# EAGLE schematic PCB-ARD-MMBOS (EAGLE 7.1.0)
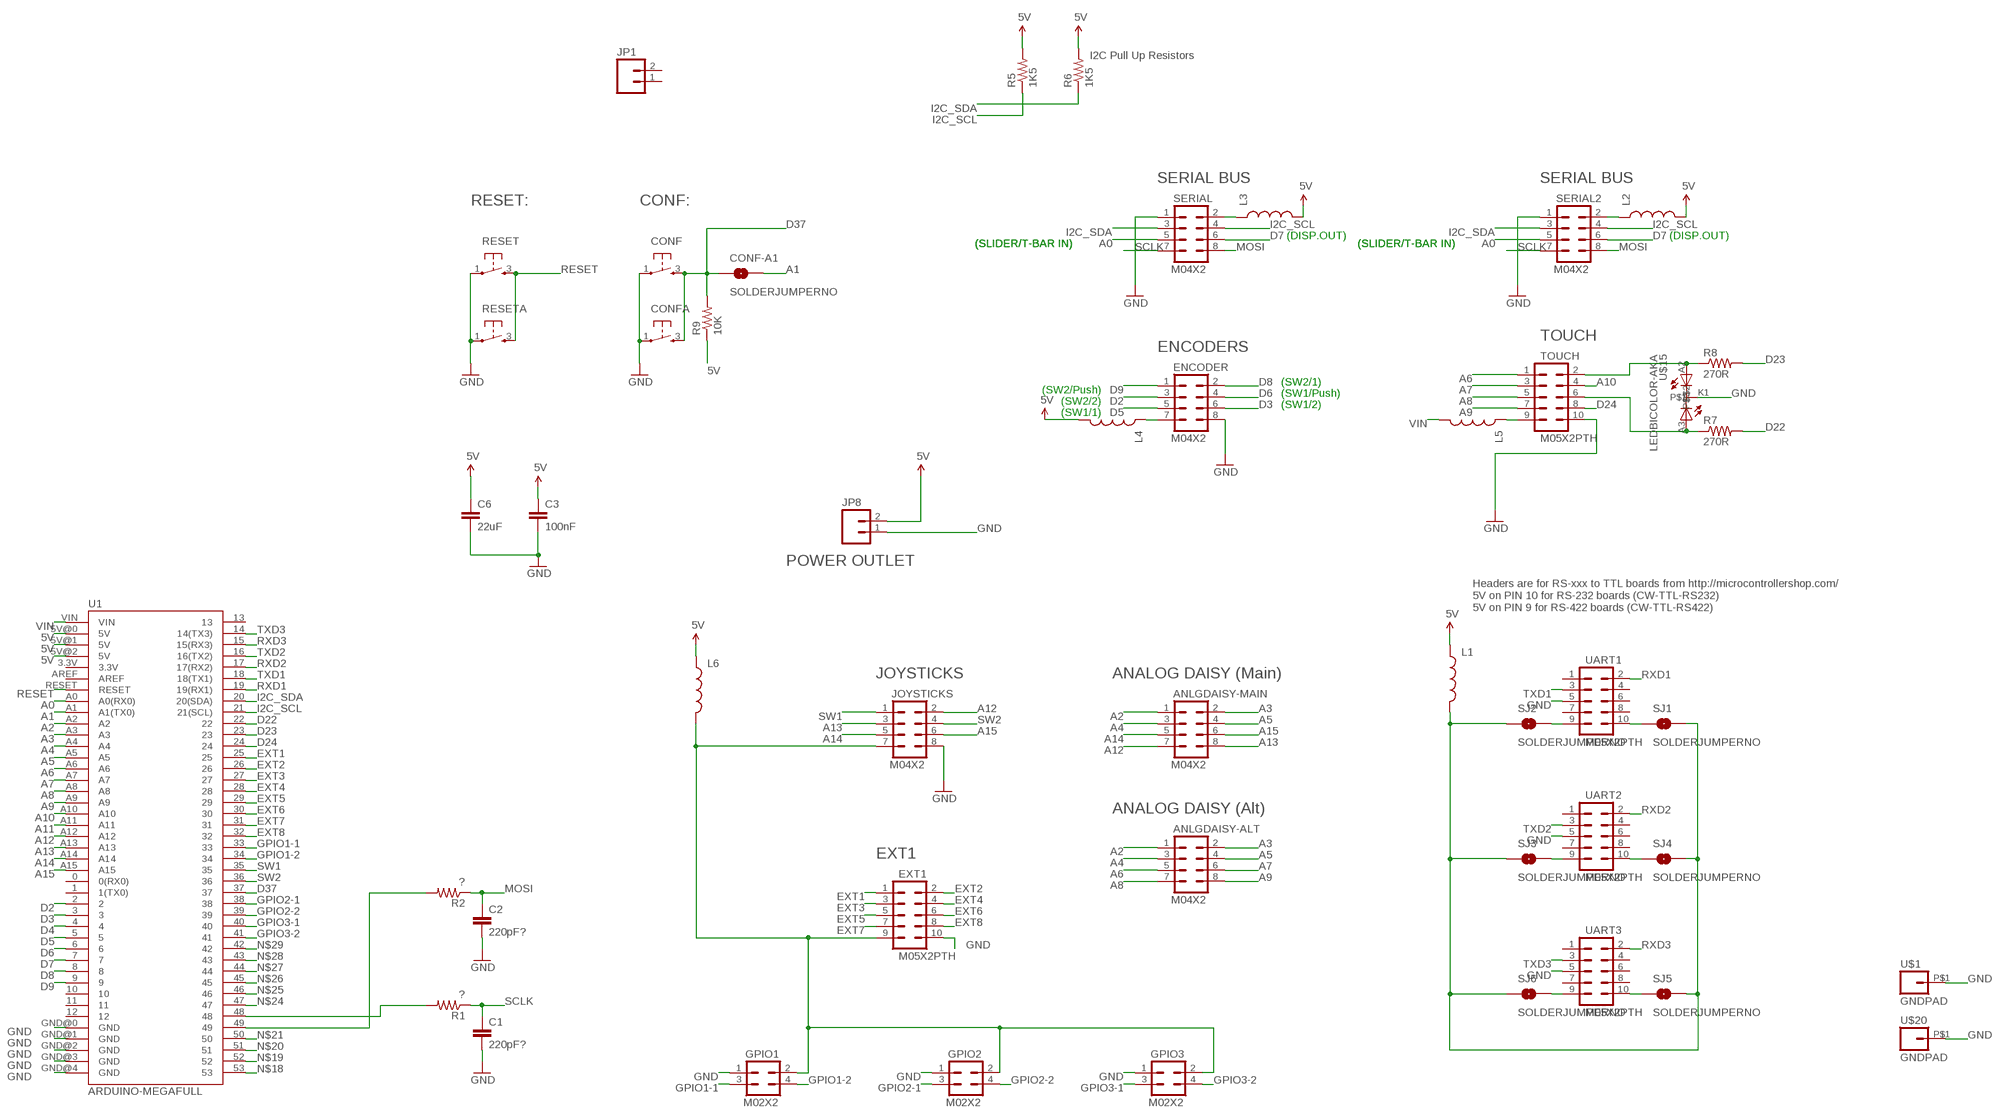
[diagram p0: schematic, sheet 1]

## Parts
ANLGDAISY-ALT  M04X2  [2X4]
ANLGDAISY-MAIN  M04X2  [2X4]
C1  220pF?  CAP0603-CAP  [0603-CAP]
C2  220pF?  CAP0603-CAP  [0603-CAP]
C3  100nF  CAP0603-CAP  [0603-CAP]
C6  22uF  CAP0805  [0805]
CONF  TAC_SWITCH  [PUSHBUTTON]
CONF-A1  SOLDERJUMPERNO  [SJ_2S-NO]
CONFA  TAC_SWITCH  [PUSHBUTTON]
ENCODER  M04X2  [2X4]
EXT1  M05X2PTH  [AVR_ICSP]
GPIO1  M02X2  [2X2]
GPIO2  M02X2  [2X2]
GPIO3  M02X2  [2X2]
JOYSTICKS  M04X2  [2X4]
JP1  M02PTH  [1X02]
JP8  M02PTH4  [1X02_XTRA_BIG]
L1  INDUCTOR0805  [0805]
L2  INDUCTOR0805  [0805]
L3  INDUCTOR0805  [0805]
L4  INDUCTOR0805  [0805]
L5  INDUCTOR0805  [0805]
L6  INDUCTOR0805  [0805]
R1  ?  RESISTOR0603-RES  [0603-RES]
R2  ?  RESISTOR0603-RES  [0603-RES]
R5  1K5  RESISTOR0603-RES  [0603-RES]
R6  1K5  RESISTOR0603-RES  [0603-RES]
R7  270R  RESISTOR0603-RES  [0603-RES]
R8  270R  RESISTOR0603-RES  [0603-RES]
R9  10K  RESISTOR0603-RES  [0603-RES]
RESET  TAC_SWITCH  [PUSHBUTTON]
RESETA  TAC_SWITCH  [PUSHBUTTON]
SERIAL  M04X2  [2X4]
SERIAL2  M04X2  [2X4]
SJ1  SOLDERJUMPERNO  [SJ_2S-NO]
SJ2  SOLDERJUMPERNO  [SJ_2S-NO]
SJ3  SOLDERJUMPERNO  [SJ_2S-NO]
SJ4  SOLDERJUMPERNO  [SJ_2S-NO]
SJ5  SOLDERJUMPERNO  [SJ_2S-NO]
SJ6  SOLDERJUMPERNO  [SJ_2S-NO]
TOUCH  M05X2PTH  [AVR_ICSP]
U1  ARDUINO-MEGAFULL  [ARDUINO_MEGA]
U$1  GNDPAD  [3.2MMPAD]
U$15  LEDBICOLOR-AKA  [LED5MM-BICOLOR]
U$20  GNDPAD  [3.2MMPAD]
UART1  M05X2PTH  [AVR_ICSP]
UART2  M05X2PTH  [AVR_ICSP]
UART3  M05X2PTH  [AVR_ICSP]

## Nets
5V [Power]: C3.1 C6.1 JP8.2 L1.1 L2.2 L3.2 L4.2 L6.1 R5.2 R6.2 R9.1 U1.5V@0(5V) U1.5V@1(5V) U1.5V@2(5V)
A0: SERIAL2.5 SERIAL.5 U1.A0(A0(RX0))
A1: CONF-A1.2 U1.A1(A1(TX0))
A2: ANLGDAISY-ALT.1 ANLGDAISY-MAIN.1 U1.A2
A3: ANLGDAISY-ALT.2 ANLGDAISY-MAIN.2 U1.A3
A4: ANLGDAISY-ALT.3 ANLGDAISY-MAIN.3 U1.A4
A5: ANLGDAISY-ALT.4 ANLGDAISY-MAIN.4 U1.A5
A6: ANLGDAISY-ALT.5 TOUCH.1 U1.A6
A7: ANLGDAISY-ALT.6 TOUCH.3 U1.A7
A8: ANLGDAISY-ALT.7 TOUCH.5 U1.A8
A9: ANLGDAISY-ALT.8 TOUCH.7 U1.A9
A10: TOUCH.4 U1.A10
A11: U1.A11
A12: ANLGDAISY-MAIN.7 JOYSTICKS.2 U1.A12
A13: ANLGDAISY-MAIN.8 JOYSTICKS.3 U1.A13
A14: ANLGDAISY-MAIN.5 JOYSTICKS.5 U1.A14
A15: ANLGDAISY-MAIN.6 JOYSTICKS.6 U1.A15
D2: ENCODER.3 U1.2
D3: ENCODER.6 U1.3
D4: U1.4
D5: ENCODER.5 U1.5
D6: ENCODER.4 U1.6
D7: SERIAL2.6 SERIAL.6 U1.7
D8: ENCODER.2 U1.8
D9: ENCODER.1 U1.9
D22: R7.2 U1.22
D23: R8.2 U1.23
D24: TOUCH.8 U1.24
D37: CONF-A1.1 CONF.3 CONFA.3 R9.2 U1.37
EXT1: EXT1.1 U1.25
EXT2: EXT1.2 U1.26
EXT3: EXT1.3 U1.27
EXT4: EXT1.4 U1.28
EXT5: EXT1.5 U1.29
EXT6: EXT1.6 U1.30
EXT7: EXT1.7 U1.31
EXT8: EXT1.8 U1.32
GND [Power]: C1.2 C2.2 C3.2 C6.2 CONF.1 CONFA.1 ENCODER.8 EXT1.10 GPIO1.1 GPIO2.1 GPIO3.1 JOYSTICKS.8 JP8.1 RESET.1 RESETA.1 SERIAL2.1 SERIAL.1 TOUCH.10 U1.GND@0(GND) U1.GND@1(GND) U1.GND@2(GND) U1.GND@3(GND) U1.GND@4(GND) U$1.P$1 U$15.K1 U$20.P$1 UART1.5 UART2.5 UART3.5
GPIO1-1: GPIO1.3 U1.33
GPIO1-2: GPIO1.4 U1.34
GPIO2-1: GPIO2.3 U1.38
GPIO2-2: GPIO2.4 U1.39
GPIO3-1: GPIO3.3 U1.40
GPIO3-2: GPIO3.4 U1.41
I2C_SCL: R5.1 SERIAL2.4 SERIAL.4 U1.21(21(SCL))
I2C_SDA: R6.1 SERIAL2.3 SERIAL.3 U1.20(20(SDA))
MOSI: C2.1 R2.1 SERIAL2.8 SERIAL.8
N$1 [Power]: L2.1 SERIAL2.2
N$2 [Power]: L3.1 SERIAL.2
N$3: SJ6.2 UART3.9
N$4 [Power]: ENCODER.7 L4.1
N$5 [Power]: L5.1 TOUCH.9
N$6: SJ3.2 UART2.9
N$7 [Power]: EXT1.9 GPIO1.2 GPIO2.2 GPIO3.2 JOYSTICKS.7 L6.2
N$8 [Power]: L1.2 SJ1.2 SJ2.1 SJ3.1 SJ4.2 SJ5.2 SJ6.1
N$9: SJ2.2 UART1.9
N$10: SJ1.1 UART1.10
N$11: R1.2 U1.48
N$12: SJ4.1 UART2.10
N$13: SJ5.1 UART3.10
N$14: R2.2 U1.49
N$17: R8.1 TOUCH.2 U$15.A2
N$18: U1.53
N$19: U1.52
N$20: U1.51
N$21: U1.50
N$22: R7.1 TOUCH.6 U$15.A3
N$24: U1.47
N$25: U1.46
N$26: U1.45
N$27: U1.44
N$28: U1.43
N$29: U1.42
RESET: RESET.3 RESETA.3 U1.RESET
RXD1: U1.19(19(RX1)) UART1.2
RXD2: U1.17(17(RX2)) UART2.2
RXD3: U1.15(15(RX3)) UART3.2
SCLK: C1.1 R1.1 SERIAL2.7 SERIAL.7
SW1: JOYSTICKS.1 U1.35
SW2: JOYSTICKS.4 U1.36
TXD1: U1.18(18(TX1)) UART1.3
TXD2: U1.16(16(TX2)) UART2.3
TXD3: U1.14(14(TX3)) UART3.3
VIN [Power]: L5.2 U1.VIN
Unconnected: JP1.1 JP1.2 U1.0(0(RX0)) U1.1(1(TX0)) U1.3.3V U1.10 U1.11 U1.12 U1.13 U1.AREF UART1.1 UART1.4 UART1.6 UART1.7 UART1.8 UART2.1 UART2.4 UART2.6 UART2.7 UART2.8 UART3.1 UART3.4 UART3.6 UART3.7 UART3.8

## Notes on the sheet
- I2C Pull Up Resistors
- SERIAL BUS | SERIAL BUS
- RESET: | CONF:
- (DISP.OUT) | (DISP.OUT)
- (SLIDER/T-BAR IN) | (SLIDER/T-BAR IN) | (SLIDER/T-BAR IN) | (SLIDER/T-BAR IN)
- TOUCH
- ENCODERS
- (SW2/Push) | (SW2/1)
- (SW2/2) | (SW1/Push)
- (SW1/1) | (SW1/2)
- POWER OUTLET
- Headers are for RS-xxx to TTL boards from http://microcontrollershop.com/
  5V on PIN 10 for RS-232 boards (CW-TTL-RS232)
  5V on PIN 9 for RS-422 boards (CW-TTL-RS422)
- JOYSTICKS | ANALOG DAISY (Main)
- ANALOG DAISY (Alt)
- EXT1

## Library data of the parts
ANLGDAISY-ALT ANLGDAISY-MAIN ENCODER JOYSTICKS SERIAL SERIAL2 = SparkFun:M04X2
C1-C3 C6 = SparkFun:CAP: Capacitor Standard 0603 ceramic capacitor, and 0.1" leaded capacitor.
CONF CONFA RESET RESETA = SKAARHOJ:TAC_SWITCH: Momentary Switch Button commonly used for reset or general input. Spark Fun Electronics SKU : COM-00097
CONF-A1 SJ1-SJ6 = SparkFun:SOLDERJUMPER: Solder Jumper Standard SMD solder jumper. Used to automate production. Two varients : Normally Open and Normally Closed are the same, but have different paste layers. NC will have a large amount of paste and should jumper during reflow.
EXT1 TOUCH UART1-UART3 = SparkFun:M05X2: Header 5x2 Standard 10-pin dual row 0.1" header. Commonly used with AVR-ISP. Use with Spark Fun Electronics SKU: PRT-00778
GPIO1-GPIO3 = SKAARHOJ:M02X2
JP1 JP8 = SparkFun:M02: Header 2 Standard 2-pin 0.1" header. Use with straight break away headers (SKU : PRT-00116), right angle break away headers (PRT-00553), swiss pins (PRT-00743), machine pins (PRT-00117), and female headers (PRT-00115). Molex polarized connector foot print use with SKU : PRT-08233 with associated crimp pins and housings.
L1-L6 = SparkFun:INDUCTOR: Inductors Basic Inductor/Choke - 0603 and 1206. Footprints are not proven and vary greatly between part numbers.
R1 R2 R5-R9 = SparkFun:RESISTOR: Resistor Basic schematic elements and footprints for 0603, 1206, and PTH resistors.
U1 = SKAARHOJ:ARDUINO-MEGA: Arduino Mega footprint connections
U$1 U$20 = SKAARHOJ:GNDPAD
U$15 = SKAARHOJ:LEDBICOLOR-AKA

## Net classes
0 default: width 0.203 mm, drill 0.61 mm, clearance 0.203 mm
1 Power: width 0.406 mm, drill 0.61 mm, clearance 0.203 mm
2 RELAY LINES: width 0.305 mm, clearance 0.203 mm
3 INput lines: clearance 0.203 mm